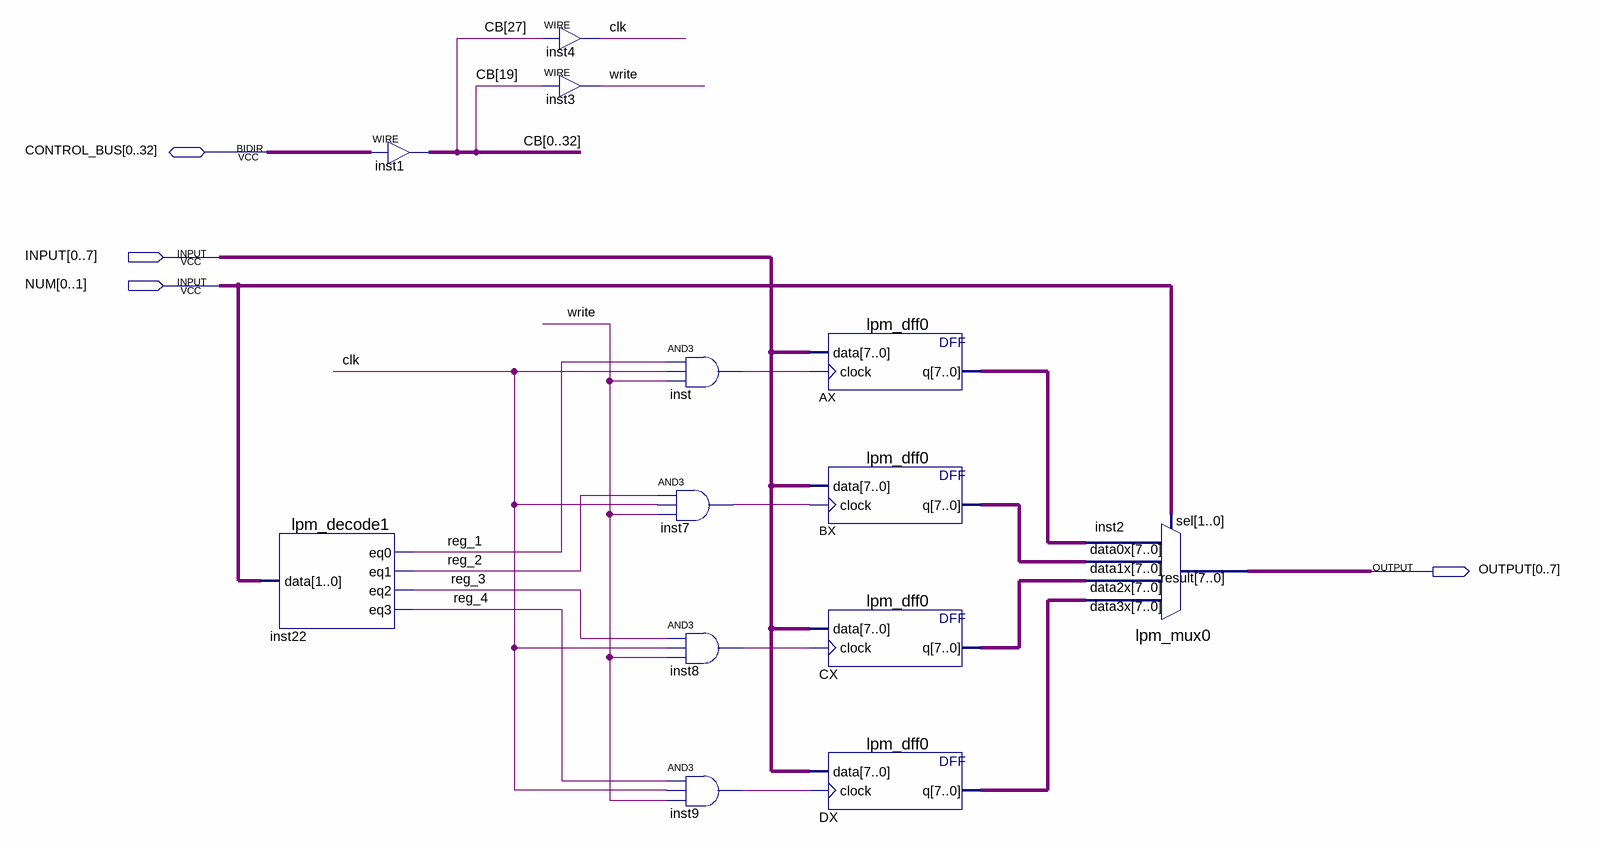
[diagram p0: schematic sheet]
// Quartus schematic RON.bdf as structural Verilog: 13 symbols, 4 pins
module RON (
  input  [0:7] INPUT,
  input  [0:1] NUM,
  inout  [0:32] CONTROL_BUS,
  output [0:7] OUTPUT
);

  wire clk, inst7_out, inst8_out, inst9_out, inst_out, reg_1, reg_2, reg_3, reg_4, write;
  wire [7:0] AX_q, BX_q, CX_q, DX_q;
  wire [32:0] CB;

  lpm_decode1 inst22 (.data(NUM), .eq0(reg_1), .eq1(reg_2), .eq2(reg_3), .eq3(reg_4));
  assign {CB[0], CB[1], CB[2], CB[3], CB[4], CB[5], CB[6], CB[7], CB[8], CB[9], CB[10], CB[11], CB[12], CB[13], CB[14], CB[15], CB[16], CB[17], CB[18], CB[19], CB[20], CB[21], CB[22], CB[23], CB[24], CB[25], CB[26], CB[27], CB[28], CB[29], CB[30], CB[31], CB[32]} = CONTROL_BUS;  // WIRE inst1
  assign clk = CB[27];  // WIRE inst4
  assign write = CB[19];  // WIRE inst3
  and inst (inst_out, reg_1, clk, write);
  and inst7 (inst7_out, reg_2, clk, write);
  and inst8 (inst8_out, reg_3, clk, write);
  and inst9 (inst9_out, reg_4, clk, write);
  lpm_dff0 AX (.data(INPUT), .clock(inst_out), .q(AX_q));
  lpm_dff0 BX (.data(INPUT), .clock(inst7_out), .q(BX_q));
  lpm_dff0 CX (.data(INPUT), .clock(inst8_out), .q(CX_q));
  lpm_dff0 DX (.data(INPUT), .clock(inst9_out), .q(DX_q));
  lpm_mux0 inst2 (.data3x(DX_q), .data2x(CX_q), .data1x(BX_q), .data0x(AX_q), .sel(NUM), .result(OUTPUT));
endmodule
